# Altium schematic sheet Teensy36AdapterBoard.SchDoc: UAV Teensy Adapter Board
size A4; DrawnBy: Stefanie Schmidiger; Organization: HSLU T&A; Address1: Abteilung Elektrotechnik; Address2: Technikumsstrasse 21; Address3: CH-6048 Horw; Revision: 1; SheetNumber: 1; SheetTotal: 1; Projektname: UAV Inspektion
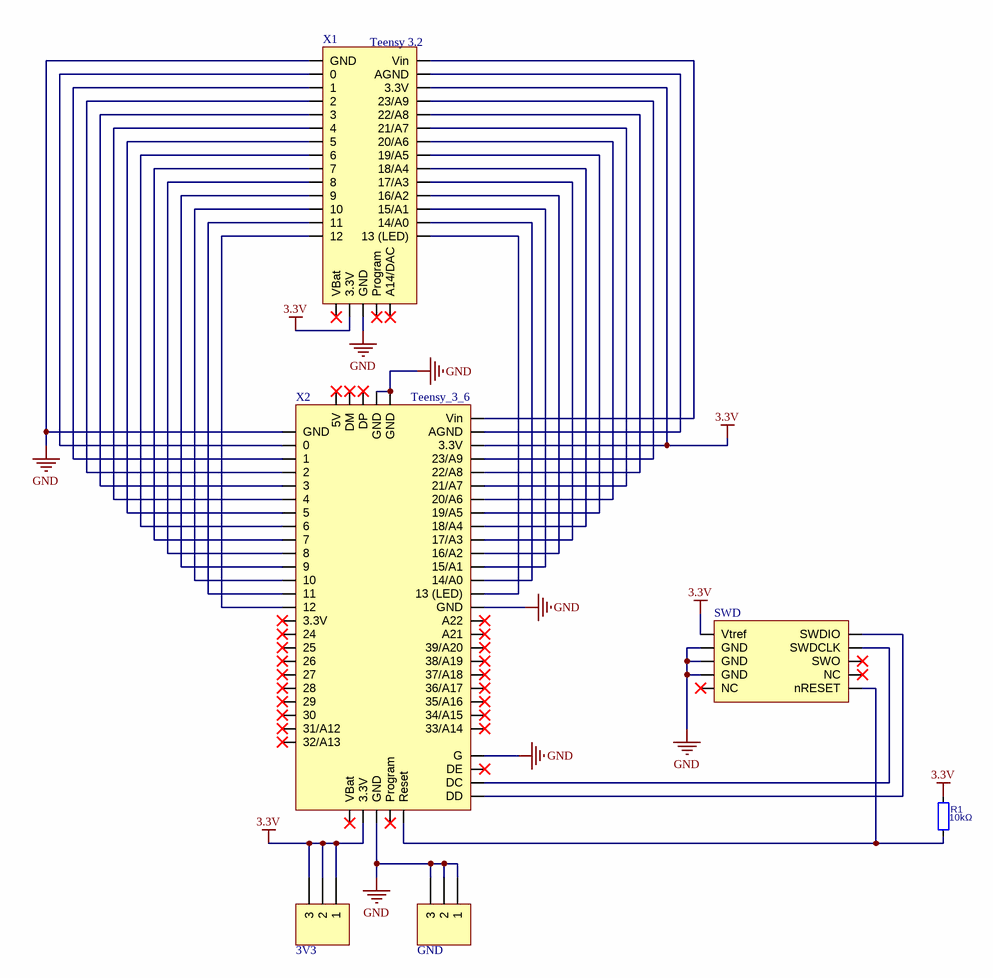
[diagram p0: Teensy36AdapterBoard.SchDoc]

## Parts
3V3  3V3  [HDR1X3]  (value not drawn)
GND  GND  [HDR1X3]  (value not drawn)
R1  10kΩ  [0805]
SWD  SWD_DebugInterface  [SWD Debug Interface 50mil]  (value not drawn)
X1  Teensy 3.2  [Teensy_3_2]
X2  Teensy_3_6

## Nets
3.3V: 3V3.1 3V3.2 3V3.3 R1.2 SWD.1(Vtref) X1.3.3V_1(3.3V) X1.3.3V_2(3.3V) X2.3.3V_1(3.3V) X2.3.3V_2(3.3V)
GND: GND.1 GND.2 GND.3 SWD.5(GND) SWD.7(GND) SWD.9(GND) X1.GND_1(GND) X1.GND_2(GND) X2.GND_1(GND) X2.GND_2(GND) X2.GND_3(GND) X2.GND_4(G) X2.GND_5(GND) X2.GND_6(GND)
NetR1_1: R1.1 SWD.10(nRESET) X2.Reset
NetSWD_2: SWD.2(SWDIO) X2.DD
NetSWD_4: SWD.4(SWDCLK) X2.DC
NetX1_0: X1.0 X2.0
NetX1_1: X1.1 X2.1
NetX1_2: X1.2 X2.2
NetX1_3: X1.3 X2.3
NetX1_4: X1.4 X2.4
NetX1_5: X1.5 X2.5
NetX1_6: X1.6 X2.6
NetX1_7: X1.7 X2.7
NetX1_8: X1.8 X2.8
NetX1_9: X1.9 X2.9
NetX1_10: X1.10 X2.10
NetX1_11: X1.11 X2.11
NetX1_12: X1.12 X2.12
NetX1_13: X1.13(13_(LED)) X2.13(13_(LED))
NetX1_14: X1.14(14/A0) X2.14(14/A0)
NetX1_15: X1.15(15/A1) X2.15(15/A1)
NetX1_16: X1.16(16/A2) X2.16(16/A2)
NetX1_17: X1.17(17/A3) X2.17(17/A3)
NetX1_18: X1.18(18/A4) X2.18(18/A4)
NetX1_19: X1.19(19/A5) X2.19(19/A5)
NetX1_20: X1.20(20/A6) X2.20(20/A6)
NetX1_21: X1.21(21/A7) X2.21(21/A7)
NetX1_22: X1.22(22/A8) X2.22(22/A8)
NetX1_23: X1.23(23/A9) X2.23(23/A9)
NetX1_AGND: X1.AGND X2.AGND
NetX1_Vin: X1.Vin X2.Vin

Not connected (* = marked no-connect by the designer): SWD 3(NC)* 6(SWO)* 8(NC)*; X1 A14(A14/DAC)* Program* VBat*; X2 3.3V* 5V_USB(5V)* 24* 25* 26* 27* 28* 29* 30* 31(31/A12)* 32(32/A13)* 33(33/A14)* 34(34/A15)* 35(35/A16)* 36(36/A17)* 37(37/A18)* 38(38/A19)* 39(39/A20)* A21* A22* DE* DM* DP* Program* VBat*

## Notes on the sheet
- Project:
- Drawn by:
- Size:
- Sheet
- A4
- Rev.:
- of
- Date:
- File:

## Library data of the parts
3V3 GND = Header 3: Header, 3-Pin; LatestRevisionDate: 17-Jul-2002; LatestRevisionNote: Re-released for DXP Platform.; Publisher: Altium Limited
R1 = 2: Widerstand 0603; Changed by: taalbiss; Number of pads: 2; Part ID: 2; Category: Resistors; Distributor: Mouser; Distributor Order Number: 71-CRCW0603-10K-E3; ComponentLink1URL: http://www.mouser.ch/Passive-Components/Resistors/SMD-Resistors-Chip-Resistors/_/N-7h7yu?P=1yzmou6; ComponentLink1Description: Mouser 0603 Resistors; Price: 0; Changed at: 21.07.2015 17:44:48; SMD: True
SWD = SWD_DebugInterface: Manufacturor Order Number: T821110A1R100CEU; Distributor: Farnell; Distributor Order Number: 2215290
X1 = Teensy_3_2: Distributor Order Number: 474-DEV-13736; Distributor: Mouser; ComponentLink1Description: Teensy 3.2 @ sparkfun; ComponentLink1URL: https://www.sparkfun.com/products/13736